# EAGLE design LED Ring Dimmer (EAGLE 9.6.2)
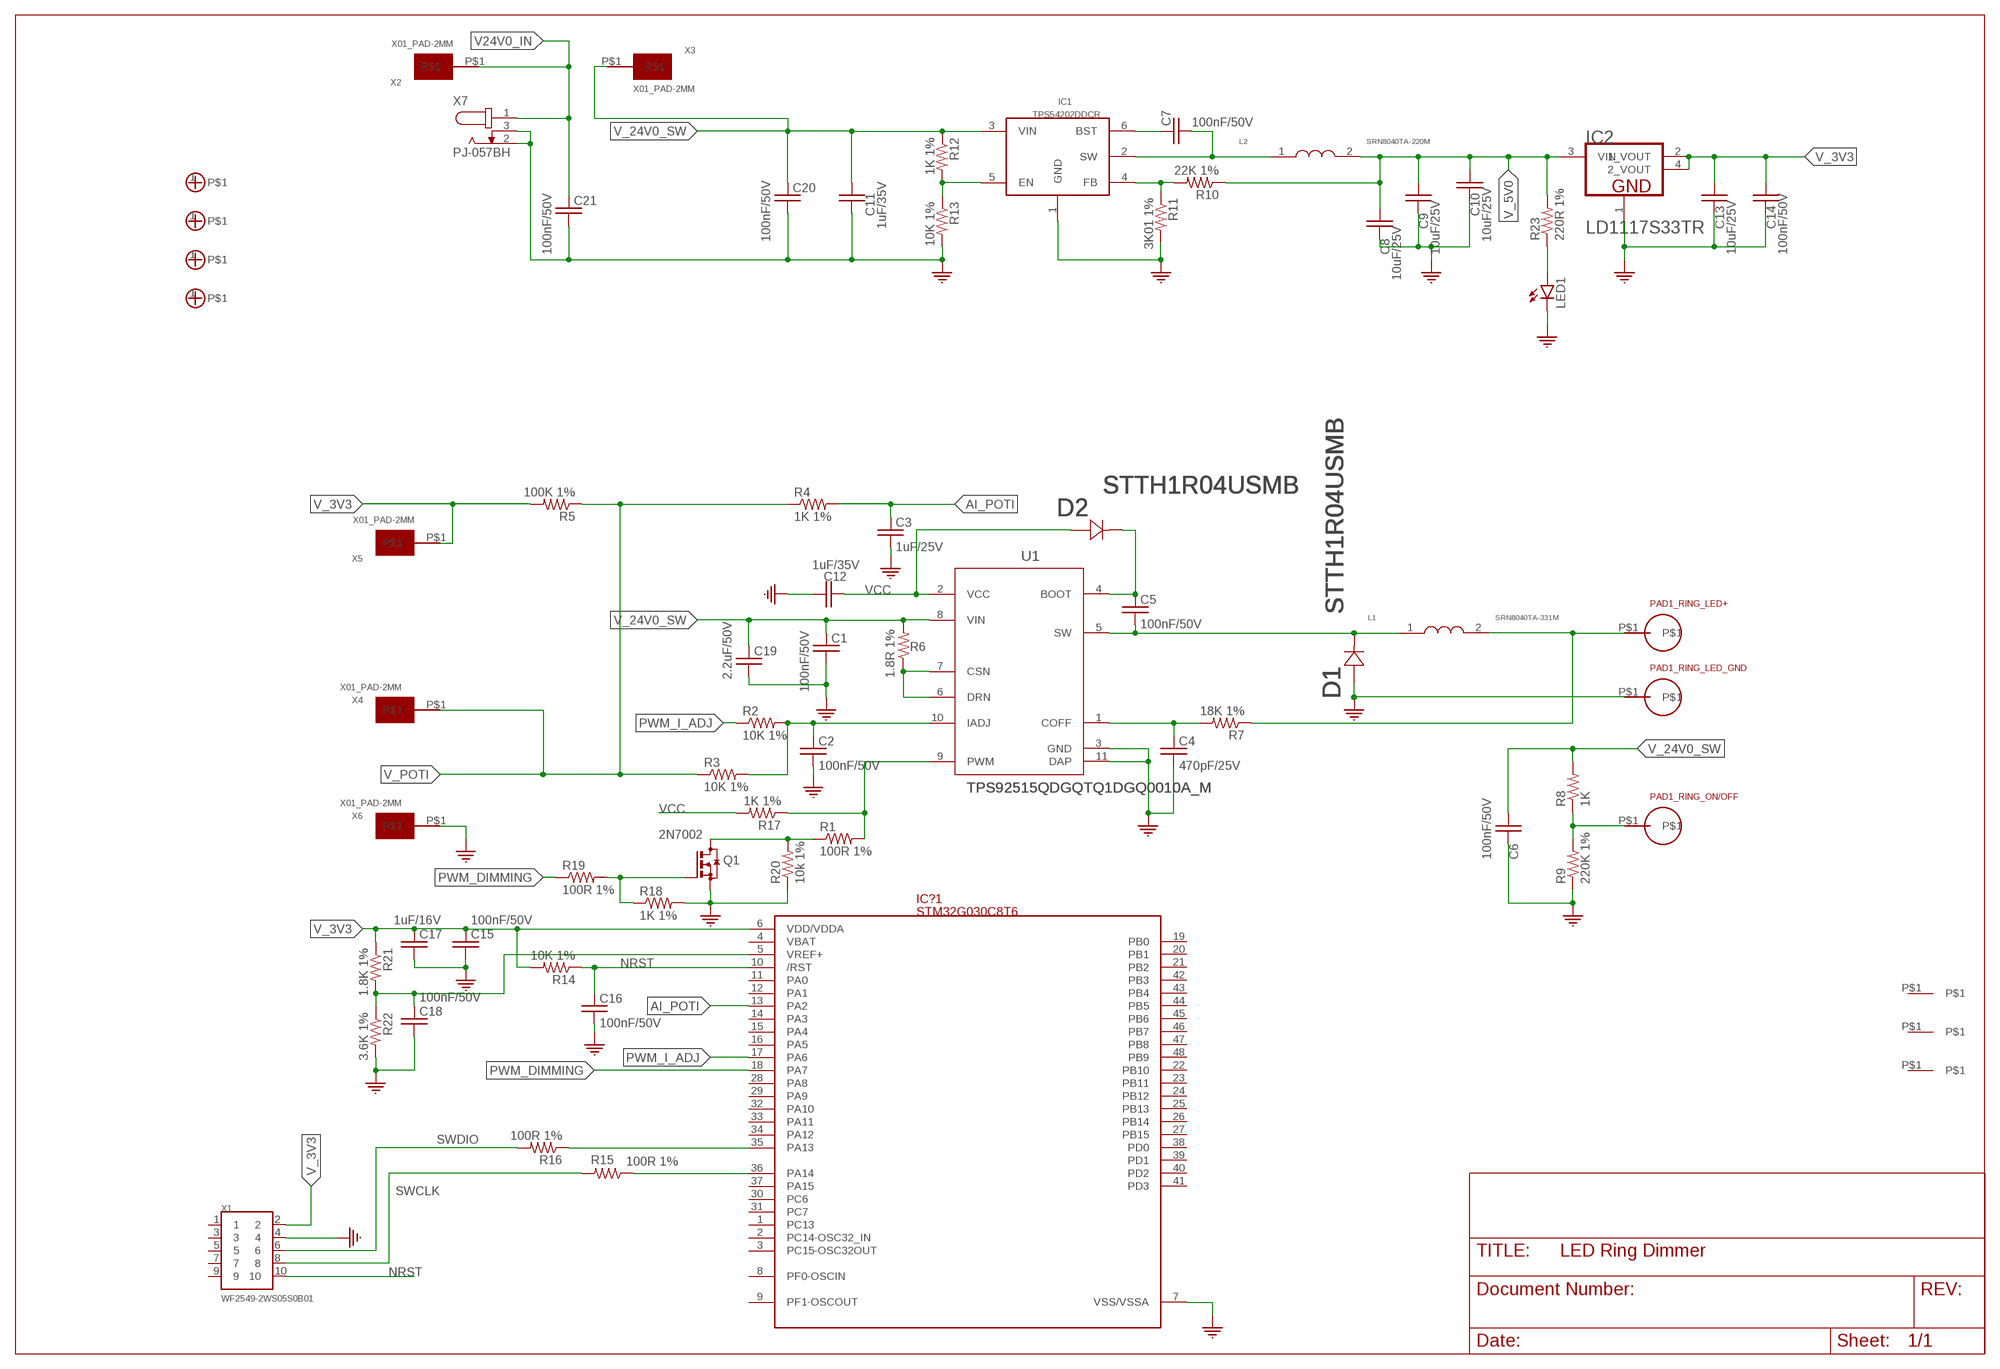
[diagram p0: schematic, sheet 1]

## Parts
C1  100nF/50V  C_0603EIA0603  [EIA0603]
C2  100nF/50V  C_0603EIA0603  [EIA0603]
C3  1uF/25V  C_0603EIA0603  [EIA0603]
C4  470pF/25V  C_0603EIA0603  [EIA0603]
C5  100nF/50V  C_0603EIA0603  [EIA0603]
C6  100nF/50V  C_0603EIA0603  [EIA0603]
C7  100nF/50V  C_0603EIA0603  [EIA0603]
C8  10uF/25V  C_0603EIA0603  [EIA0603]
C9  10uF/25V  C_0603EIA0603  [EIA0603]
C10  10uF/25V  C_0603EIA0603  [EIA0603]
C11  1uF/35V  C_0603EIA0603  [EIA0603]
C12  1uF/35V  C_0603EIA0603  [EIA0603]
C13  10uF/25V  C_0603EIA0603  [EIA0603]
C14  100nF/50V  C_0603EIA0603  [EIA0603]
C15  100nF/50V  C_0603EIA0603  [EIA0603]
C16  100nF/50V  C_0603EIA0603  [EIA0603]
C17  1uF/16V  C_0603EIA0603  [EIA0603]
C18  100nF/50V  C_0603EIA0603  [EIA0603]
C19  2.2uF/50V  C_0603EIA0603  [EIA0603]
C20  100nF/50V  C_0603EIA0603  [EIA0603]
C21  100nF/50V  C_0603EIA0603  [EIA0603]
D1  STTH1R04USMB  [SMB]
D2  STTH1R04USMB  [SMB]
FID1  FIDUCIAL  [FIDUCIAL]
FID2  FIDUCIAL  [FIDUCIAL]
FID3  FIDUCIAL  [FIDUCIAL]
IC1  TPS54202DDCR  [SOT23-6]
IC2  LD1117S33TR  [SOT223_LD1117S33TR]
IC?1  STM32G030C8T6  [LQFP48]
L1  SRN8040TA-331M  [SRN8040TA-220M]
L2  SRN8040TA-220M  [SRN8040TA-220M]
LED1  LED5MM  [LED5MM]
M1  M_HOLE_3M  [PCB_SCREW_M3_POWER]
M2  M_HOLE_3M  [PCB_SCREW_M3_POWER]
M3  M_HOLE_3M  [PCB_SCREW_M3_POWER]
M4  M_HOLE_3M  [PCB_SCREW_M3_POWER]
PAD1_RING_LED+  THT_PAD_5MM  [THT_PAD_D5.0]
PAD1_RING_LED_GND  THT_PAD_5MM  [THT_PAD_D5.0]
PAD1_RING_ON/OFF  THT_PAD_5MM  [THT_PAD_D5.0]
Q1  2N7002  [SOT23]
R1  100R 1%  R_0603  [EIA0603]
R2  10K 1%  R_0603  [EIA0603]
R3  10K 1%  R_0603  [EIA0603]
R4  1K 1%  R_0603  [EIA0603]
R5  100K 1%  R_0603  [EIA0603]
R6  1.8R 1%  R_1206EIA1206  [EIA1206]
R7  18K 1%  R_0603  [EIA0603]
R8  1K  R_0603  [EIA0603]
R9  220K 1%  R_0603  [EIA0603]
R10  22K 1%  R_0603  [EIA0603]
R11  3K01 1%  R_0603  [EIA0603]
R12  1K 1%  R_0603  [EIA0603]
R13  10K 1%  R_0603  [EIA0603]
R14  10K 1%  R_0603  [EIA0603]
R15  100R 1%  R_0603  [EIA0603]
R16  100R 1%  R_0603  [EIA0603]
R17  1K 1%  R_0603  [EIA0603]
R18  1K 1%  R_0603  [EIA0603]
R19  100R 1%  R_0603  [EIA0603]
R20  10k 1%  R_0603  [EIA0603]
R21  1.8K 1%  R_0603  [EIA0603]
R22  3.6K 1%  R_0603  [EIA0603]
R23  220R 1%  R_1206EIA1206  [EIA1206]
U1  TPS92515QDGQTQ1DGQ0010A_M  [DGQ0010A_M]
X1  WF2549-2WS05S0B01  [X10_100MIL_2XROW_VERT]
X2  X01_PAD-2MM  [X01_PAD-2MM]
X3  X01_PAD-2MM  [X01_PAD-2MM]
X4  X01_PAD-2MM  [X01_PAD-2MM]
X5  X01_PAD-2MM  [X01_PAD-2MM]
X6  X01_PAD-2MM  [X01_PAD-2MM]
X7  PJ-057BH  [CUI_PJ-057BH]

## Nets
AI_POTI: C3.1 IC?1.13(PA2) R4.2
GND: C1.2 C2.2 C3.2 C4.2 C6.2 C8.2 C9.2 C10.2 C11.2 C12.1 C13.2 C14.2 C15.2 C16.2 C17.2 C18.2 C19.2 C20.2 C21.2 D1.A IC1.1(GND) IC2.1(GND) IC?1.7(VSS/VSSA) LED1.K(C) PAD1_RING_LED_GND.P$1 Q1.2(S) R9.1 R11.2 R13.2 R18.2 R20.1 R22.2 U1.3(GND) U1.11(DAP) X1.4 X6.P$1 X7.2 X7.3
N$1: LED1.A R23.1
N$2: C5.2 D1.K(C) L1.1 U1.5(SW)
N$3: R6.1 U1.6(DRN) U1.7(CSN)
N$4: C2.1 R2.2 R3.2 U1.10(IADJ)
N$5: C4.1 R7.2 U1.1(COFF)
N$6: R1.2 R17.1 U1.9(PWM)
N$7: L1.2 PAD1_RING_LED+.P$1 R7.1
N$8: C5.1 D2.K(C) U1.4(BOOT)
N$9: PAD1_RING_ON/OFF.P$1 R8.1 R9.2
N$10: C7.1 IC1.6(BST)
N$11: C7.2 IC1.2(SW) L2.1
N$12: IC1.4(FB) R10.2 R11.1
N$13: Q1.3(D) R1.1 R20.2
N$14: IC1.5(EN) R12.2 R13.1
N$15: Q1.1(G) R18.1 R19.2
N$16: C18.1 IC?1.5(VREF+) R21.2 R22.1
N$17: IC?1.35(PA13) R16.1
N$18: IC?1.36(PA14) R15.1
NRST: C16.1 IC?1.10(/RST) R14.1 X1.10
PWM_DIMMING: IC?1.18(PA7) R19.1
PWM_I_ADJ: IC?1.17(PA6) R2.1
SWCLK: R15.2 X1.8
SWDIO: R16.2 X1.6
V24V0_IN: C21.1 X2.P$1 X7.1
V_3V3: C13.1 C14.1 C15.1 C17.1 IC2.2(1_VOUT) IC2.4(2_VOUT) IC?1.6(VDD/VDDA) R5.2 R14.2 R21.1 X1.2 X5.P$1
V_5V0: C8.1 C9.1 C10.1 IC2.3(VIN) L2.2 R10.1 R23.2
V_24V0_SW: C1.1 C6.1 C11.1 C19.1 C20.1 IC1.3(VIN) R6.2 R8.2 R12.1 U1.8(VIN) X3.P$1
V_POTI: R3.1 R4.1 R5.1 X4.P$1
VCC: C12.2 D2.A R17.2 U1.2(VCC)
Unconnected: FID1.P$1 FID2.P$1 FID3.P$1 IC?1.1(PC13) IC?1.2(PC14-OSC32_IN) IC?1.3(PC15-OSC32OUT) IC?1.4(VBAT) IC?1.8(PF0-OSCIN) IC?1.9(PF1-OSCOUT) IC?1.11(PA0) IC?1.12(PA1) IC?1.14(PA3) IC?1.15(PA4) IC?1.16(PA5) IC?1.19(PB0) IC?1.20(PB1) IC?1.21(PB2) IC?1.22(PB10) IC?1.23(PB11) IC?1.24(PB12) IC?1.25(PB13) IC?1.26(PB14) IC?1.27(PB15) IC?1.28(PA8) IC?1.29(PA9) IC?1.30(PC6) IC?1.31(PC7) IC?1.32(PA10) IC?1.33(PA11) IC?1.34(PA12) IC?1.37(PA15) IC?1.38(PD0) IC?1.39(PD1) IC?1.40(PD2) IC?1.41(PD3) IC?1.42(PB3) IC?1.43(PB4) IC?1.44(PB5) IC?1.45(PB6) IC?1.46(PB7) IC?1.47(PB8) IC?1.48(PB9) M1.1 M2.1 M3.1 M4.1 X1.1 X1.3 X1.5 X1.7 X1.9

## Library data of the parts
C1-C21 = Labops_Lib_AH:C_0603
D1 D2 = Labops_Lib_AH:STTH1R04U; DESCRIPTION: 1A, 400V, SMB, Fast Recovery; MFN: STTH1R04U; PART_VALUE: STTH1R04U
FID1-FID3 = Labops_Lib_AH:FIDUCIAL
IC1 = Labops_Lib_AH:TPS54202DDCR; DESCRIPTION: 2A 28V SOT-23-6 Sync Buck; LIB_STATUS: Prototype; MFN: TPS54202DDCR; MFR: Texas Instruments; OUR_STOCK: 40; PART_VALUE: TPS54202; PRICE-1: 1.8; SUPPLIER-1: LCSC
IC2 = Labops_Lib_AH:LD1117S33TR: IC REG LINEAR 3.3V 800mA SOT223; DESCRIPTION: LDO,Fixed 15V 3.3V 1.3V @ 800mA SOT-223; LIB_STATUS: Verified; MFN: LD1117S33TR; MFR: STmicro, Diodes, TI,; OUR_STOCK: 10; PART_VALUE: xx1117x33xx; PRICE-1: 0.07; SUPPLIER-1: LCSC
IC?1 = Labops_Lib_AH:STM32G030C8T6
L1 = Labops_Lib_AH:SRN8040TA-331M: FIXED IND 22UH 2.9A SMD, 73m-Ohm, Bourns; DESCRIPTION: FIXED IND 330UH 0.66A SMD, Bourns; LIB_STATUS: Verified; MFN: SRN8040TA-331M; MFR: Bourns; OUR_STOCK: 10; PART_VALUE: 330uH/0.66A; SUPPLIER-1: Digikey; TECHNOLOGY: SMD
L2 = Labops_Lib_AH:SRN8040TA-220M: FIXED IND 22UH 2.9A SMD, 73m-Ohm, Bourns; DESCRIPTION: FIXED IND 22UH 2.9A SMD, 73m-Ohm, Bourns; LIB_STATUS: Verified; MFN: SRN8040TA-220M; MFR: Bourns; OUR_STOCK: 10; PART_VALUE: 22uH/2.9A; SUPPLIER-1: Digikey; TECHNOLOGY: SMD
LED1 = led:LED: LED OSRAM: - CHIPLED LG R971, LG N971, LY N971, LG Q971, LY Q971, LO R971, LY R971 LH N974, LH R974 LS Q976, LO Q976, LY Q976 LO Q996 - Hyper CHIPLED LW Q18S LB Q993, LB Q99A, LB R99A - SideLED LS A670, LO A670, LY A670, LG A670, LP A670 LB A673, LV A673, LT A673, LW A673 LH A674 LY A675 LS A676, LA A676, LO A676, LY A676, LW A676 LS A679, LY A679, LG A679 - Hyper Micro SIDELED® LS Y876, LA Y876, LO Y876, LY Y876 LT Y87S - SmartLED LW L88C, LW L88S LB L89C, LB L89S, LG L890 LS L89K, LO L89K, LY L89K LS L896, LA L896, LO L896, LY L896 - TOPLED LS T670, LO T670, LY T670, LG T670, LP T670 LSG T670, LSP T670, LSY T670, LOP T670, LYG T670 LG T671, LOG T671, LSG T671 LB T673, LV T673, LT T673, LW T673 LH T674 LS T676, LA T676, LO T676, LY T676, LB T676, LH T676, LSB T676, LW T676 LB T67C, LV T67C, LT T67C, LS T67K, LO T67K, LY T67K, LW E67C LS E67B, LA E67B, LO E67B, LY E67B, LB E67C, LV E67C, LT E67C LW T67C LS T679, LY T679, LG T679 LS T770, LO T770, LY T770, LG T770, LP T770 LB T773, LV T773, LT T773, LW T773 LH T774 LS E675, LA E675, LY E675, LS T675 LS T776, LA T776, LO T776, LY T776, LB T776 LHGB T686 LT T68C, LB T68C - Hyper Mini TOPLED® LB M676 - Mini TOPLED Santana® LG M470 LS M47K, LO M47K, LY M47K Source: http://www.osram.convergy.de LUXEON: - LUMILED® LXK2-PW12-R00, LXK2-PW12-S00, LXK2-PW14-U00, LXK2-PW14-V00 LXK2-PM12-R00, LXK2-PM12-S00, LXK2-PM14-U00 LXK2-PE12-Q00, LXK2-PE12-R00, LXK2-PE12-S00, LXK2-PE14-T00, LXK2-PE14-U00 LXK2-PB12-K00, LXK2-PB12-L00, LXK2-PB12-M00, LXK2-PB14-N00, LXK2-PB14-P00, LXK2-PB14-Q00 LXK2-PR12-L00, LXK2-PR12-M00, LXK2-PR14-Q00, LXK2-PR14-R00 LXK2-PD12-Q00, LXK2-PD12-R00, LXK2-PD12-S00 LXK2-PH12-R00, LXK2-PH12-S00 LXK2-PL12-P00, LXK2-PL12-Q00, LXK2-PL12-R00 Source: www.luxeon.com KINGBRIGHT: KA-3528ASYC Source: www.kingbright.com
M1-M4 = Labops_Lib_AH:M_HOLE_3M
PAD1_RING_LED+ PAD1_RING_LED_GND PAD1_RING_ON/OFF = Labops_Lib_AH:THT_PAD_5MM
Q1 = Labops_Lib_AH:2N7002; DESCRIPTION: NMOSFET, 500mA, 60V, Vth 2.5V; LIB_STATUS: Prototype; MFN: 2N7002; MFR: Diodes, Guangdong Hotetech,NXP; OUR_STOCK: 100; PART_VALUE: NMOSFET; PRICE-1: 0.02; SUPPLIER-1: LCSC
R1-R5 R7-R22 = Labops_Lib_AH:R_0603; MFN: Open Source 0603
R6 R23 = Labops_Lib_AH:R_1206; MFN: Open Source R1206
U1 = Labops_Lib_AH:TPS92515QDGQTQ1; COPYRIGHT: Copyright (C) 2023 Ultra Librarian. All rights reserved.; DESCRIPTION: LED Driver 2A, 42V, Buck, Analog and PWM Dimming,MSOP-PowerPad-10; MFN: TPS92515QDGQTQ1; MFR: Texas Instruments; PART_VALUE: TPS92515; REFDES: RefDes; TYPE: TYPE
X1 = Labops_Lib_AH:WF2549-2WS05S0B01; DESCRIPTION: X10, 10 Pins, Header, Pitch 2.54 wire to board 2xrows, THT; MFN: WF2549-2WS05S0B01; MFR: WCON; PRICE-1: 0.25; SUPPLIER-1: LCSC
X2-X6 = Labops_Lib_AH:X01_PAD-2MM
X7 = Labops_Lib_AH:PJ-057BH; DESCRIPTION: DC Power Connectors Power Jack 2.5mm, 2.5A, Male; MFN: PJ-057BH; MFR: CUI Devices; SUPPLIER-1: Mouser; TECHNOLOGY: THT

## Net classes
5 LV: width 0.203 mm, clearance 7 mm to class 1, clearance 7 mm to class 2, clearance 7 mm to class 3, clearance 7 mm to class 4, clearance 0.203 mm

## Board
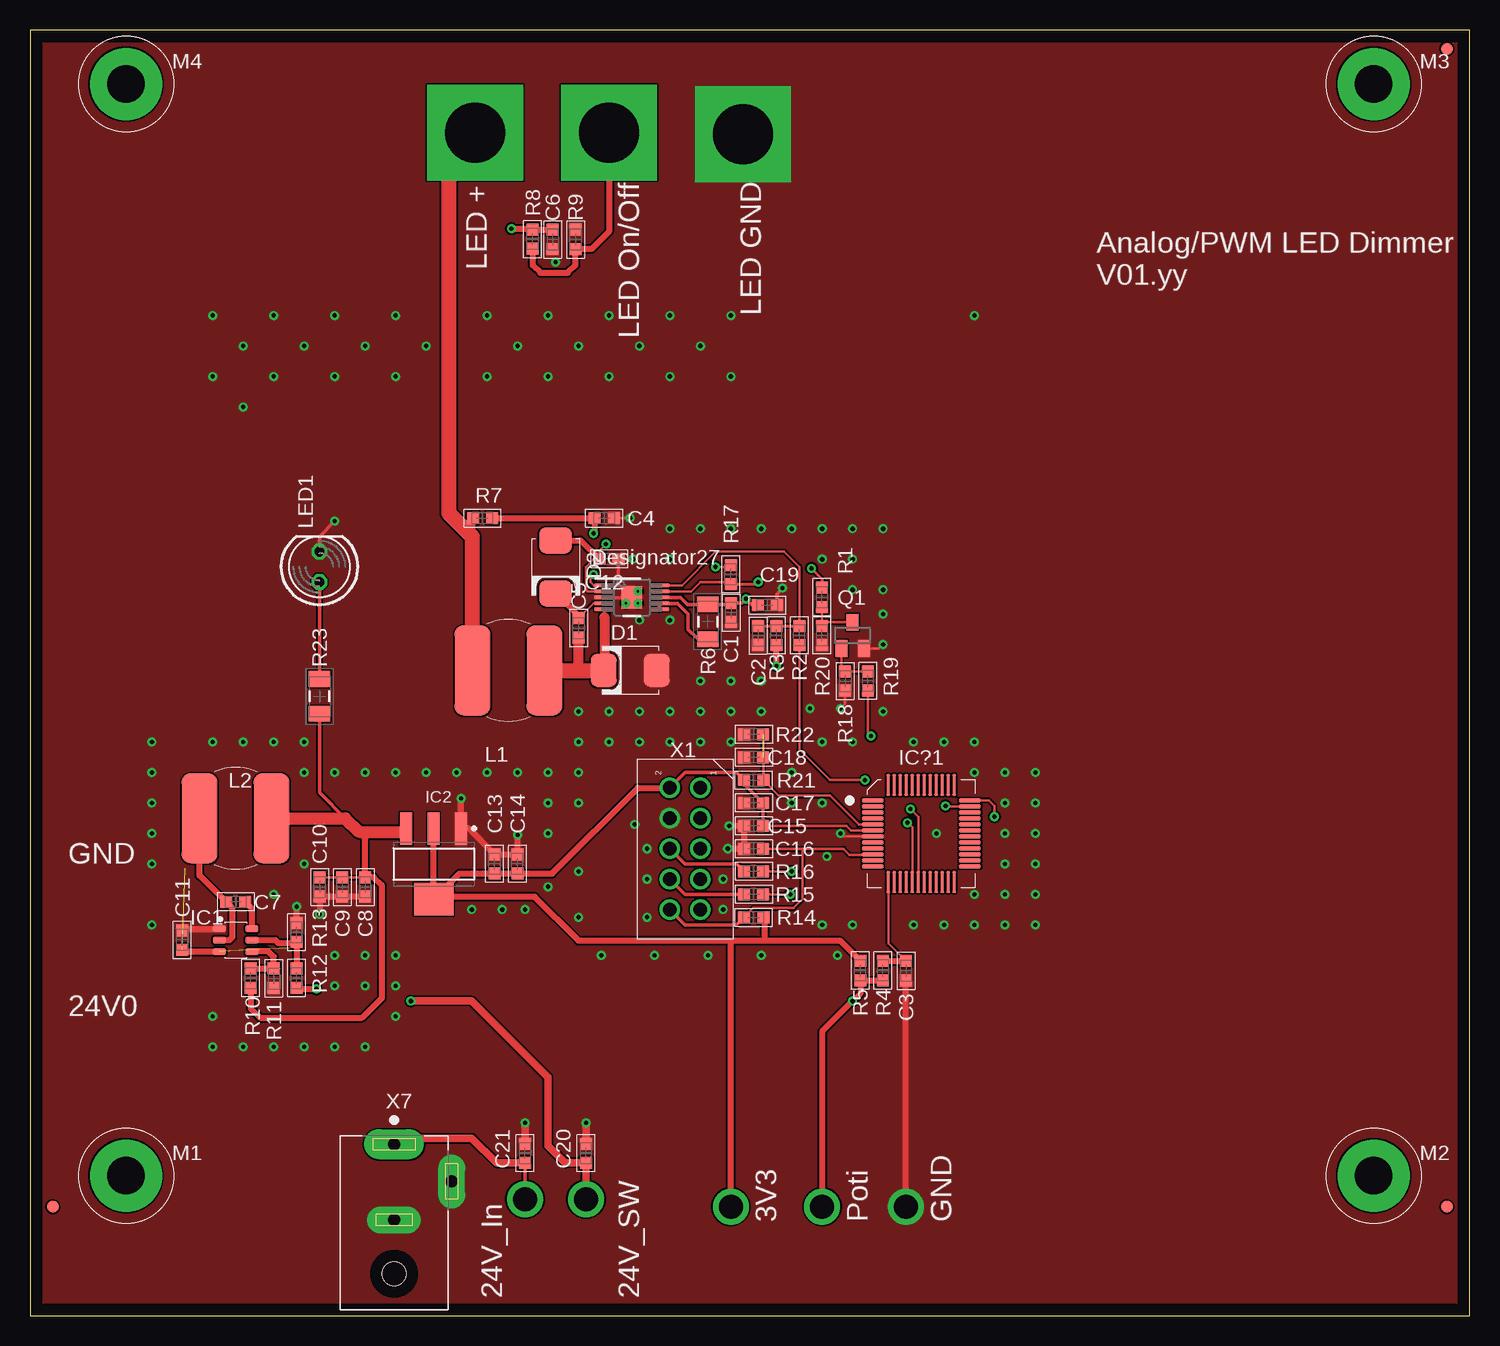
[diagram p1: board, top side]
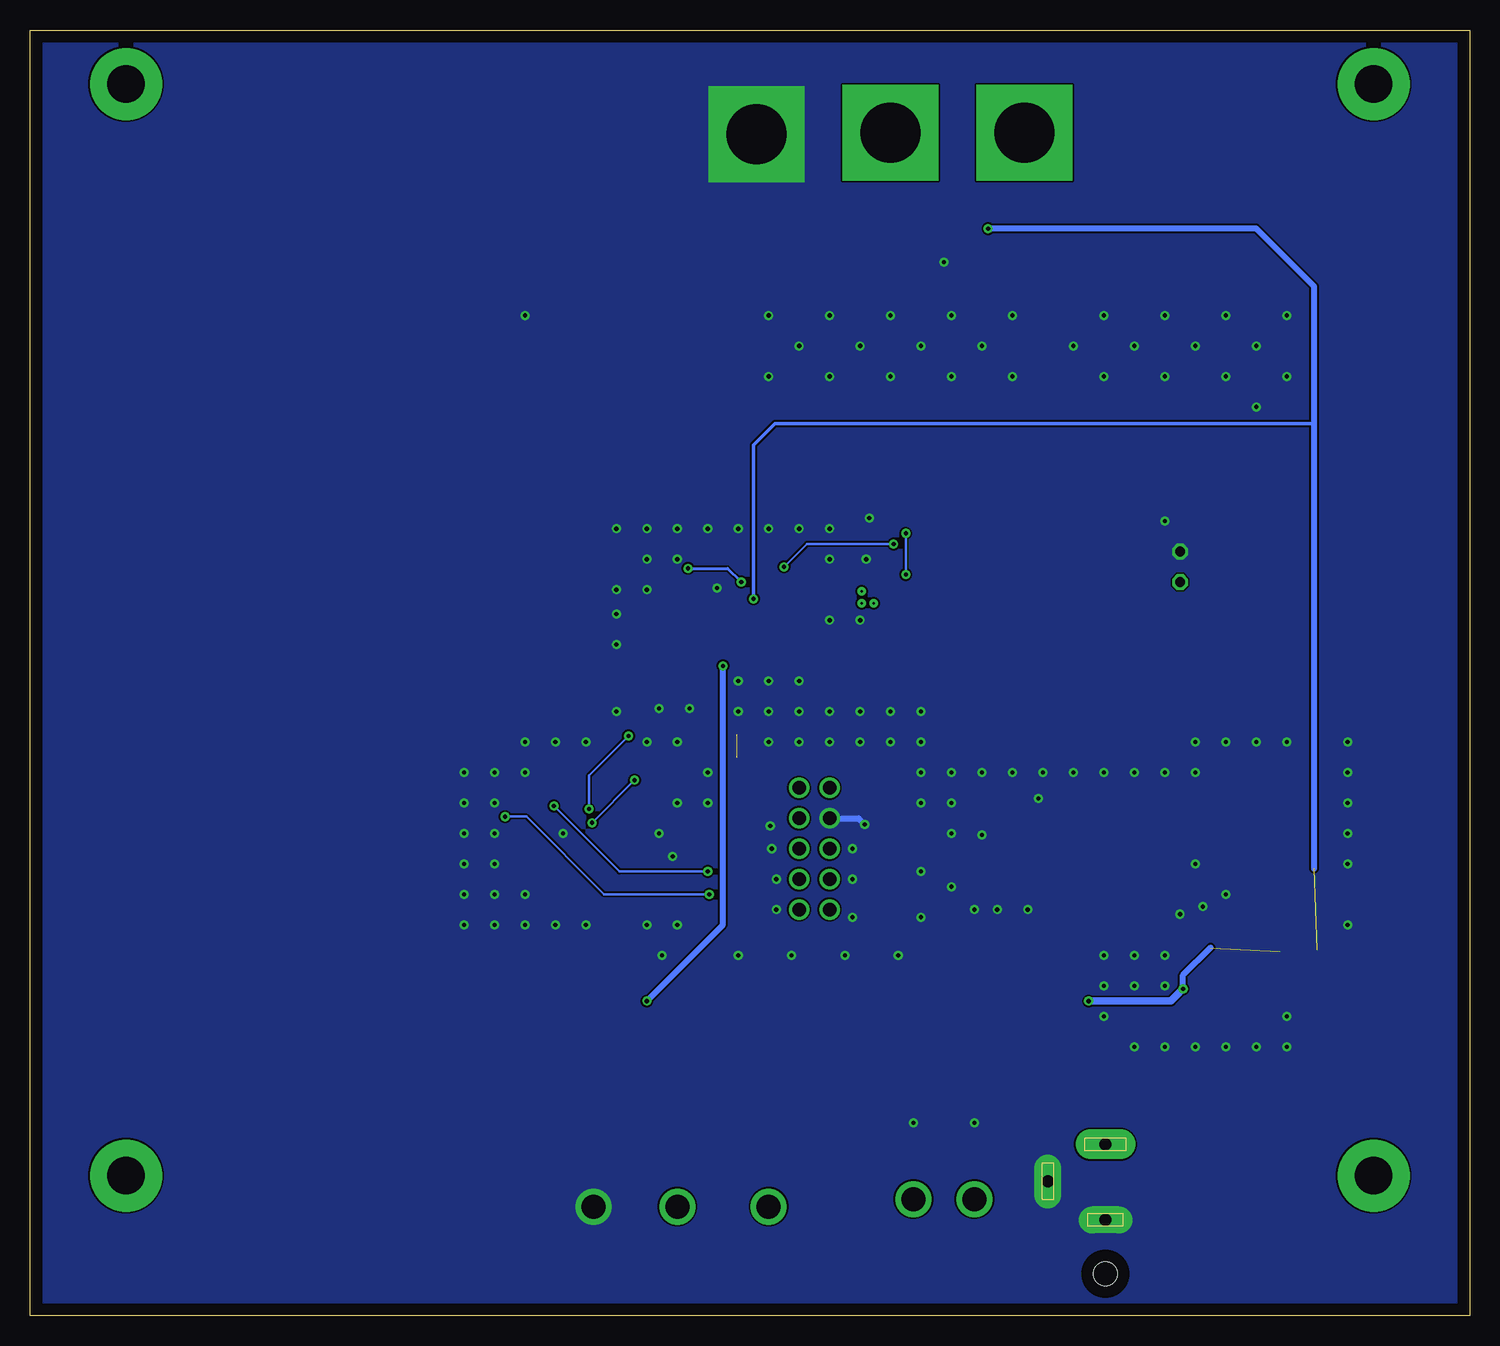
[diagram p2: board, bottom side, seen from below]

Size 120 x 107.19 mm. Coordinates in mm from the lower left corner, seen from the top.
Outline: 0,0 120,0 120,107.19 0,107.19 0,0
Copper layers (1*16): Top 0.035mm / dielectric 1.5mm / Bottom 0.035mm
Design rules "default *": minimum track width 6mil, minimum drill 0.35mm, track to track 6mil, track to pad 6mil, pad to pad 6mil, via to via 6mil, smd to smd 6mil, copper to edge 40mil, drill to drill 6mil, minimum pad ring 10mil, minimum via ring 8mil, stop-mask expansion 4mil, vias tented up to drill 20mil, thermal gap 10mil

### Footprints (pad centres in the part's own frame; a part is rotated, then mirrored left to right if it is on the bottom)
EIA0603 = smd 1 x 1: 1 -0.8,0; 2 0.8,0
SMB = smd 2.16 x 2.74: A -2.21,0; K 2.21,0
FIDUCIAL = smd 1 x 1: P$1 0,0
SOT23-6 = smd 0.6 x 1.1: 1 -0.95,-1.35; 2 0,-1.35; 3 0.95,-1.35; 4 0.95,1.35; 5 0,1.35; 6 -0.95,1.35
SOT223_LD1117S33TR = smd 2.7 x 1: 1 -2.95,2.3; 2 -2.95,0; 3 -2.95,-2.3 | smd 2.7 x 3.3: 4 2.95,0
LQFP48 = smd 1.8 x 0.3: 1 -4.05,2.75; 2 -4.05,2.25; 3 -4.05,1.75; 4 -4.05,1.25; 5 -4.05,0.75; 6 -4.05,0.25; 7 -4.05,-0.25; 8 -4.05,-0.75; 9 -4.05,-1.25; 10 -4.05,-1.75; 11 -4.05,-2.25; 12 -4.05,-2.75; 25 4.05,-2.75; 26 4.05,-2.25; 27 4.05,-1.75; 28 4.05,-1.25; 29 4.05,-0.75; 30 4.05,-0.25; 31 4.05,0.25; 32 4.05,0.75; 33 4.05,1.25; 34 4.05,1.75; 35 4.05,2.25; 36 4.05,2.75 | smd 0.3 x 1.8: 13 -2.75,-4.05; 14 -2.25,-4.05; 15 -1.75,-4.05; 16 -1.25,-4.05; 17 -0.75,-4.05; 18 -0.25,-4.05; 19 0.25,-4.05; 20 0.75,-4.05; 21 1.25,-4.05; 22 1.75,-4.05; 23 2.25,-4.05; 24 2.75,-4.05; 37 2.75,4.05; 38 2.25,4.05; 39 1.75,4.05; 40 1.25,4.05; 41 0.75,4.05; 42 0.25,4.05; 43 -0.25,4.05; 44 -0.75,4.05; 45 -1.25,4.05; 46 -1.75,4.05; 47 -2.25,4.05; 48 -2.75,4.05
SRN8040TA-220M = smd 3 x 7.5: 1 -3,0; 2 3,0
LED5MM = drill 0.813 octagon: A -1.27,0; K 1.27,0
PCB_SCREW_M3_POWER = drill 3.1 pad 6: 1 0,0
THT_PAD_D5.0 = drill 5 pad 8 square: P$1 0,0
SOT23 = smd 1 x 1.4: 1 -0.95,-1.1; 2 0.95,-1.1; 3 0,1.1
EIA1206 = smd 1.3 x 1.8: 1 -1.45,0; 2 1.45,0
DGQ0010A_M = smd 1.55 x 0.3: 1 -2.325,1; 2 -2.325,0.5; 3 -2.325,0; 4 -2.325,-0.5; 5 -2.325,-1; 6 2.325,-1; 7 2.325,-0.5; 8 2.325,0; 9 2.325,0.5; 10 2.325,1 | smd 1.73 x 1.9: 11 0,0 | drill 0.203 pad 0.5: V_1 0.5,0.5; V_2 -0.5,-0.5; V_3 0.5,-0.5
X10_100MIL_2XROW_VERT = drill 1.1 pad 1.7: 1 -5.08,1.27; 2 -5.08,-1.27; 3 -2.54,1.27; 4 -2.54,-1.27; 5 0,1.27; 6 0,-1.27; 7 2.54,1.27; 8 2.54,-1.27; 9 5.08,1.27; 10 5.08,-1.27
X01_PAD-2MM = drill 2: P$1 0,0
CUI_PJ-057BH = drill 1 pad 2.5 long: 1 0,0 | drill 1 pad 2.25 long: 2 6.3,0; 3 3.1,4.8 | hole 2: 10.8,0

### Placement (x,y rotation side)
C1  58.42,58.63 270 top
C2  60.71,56.73 270 top
C3  73.03,28.79 270 top
C4  47.88,66.5 0 top
C5  45.72,57.36 270 top
C6  43.56,89.75 270 top
C7  17.14,34.5 180 top
C8  27.94,35.77 270 top
C9  26.04,35.77 270 top
C10  24.13,35.77 270 top
C11  12.7,31.32 90 top
C12  48.26,63.08 180 top
C13  38.73,37.67 90 top
C14  40.64,37.67 90 top
C15  60.33,40.85 180 top
C16  60.33,38.95 180 top
C17  60.33,42.76 180 top
C18  60.33,46.56 180 top
C19  61.47,59.27 0 top
C20  46.35,13.54 90 top
C21  41.27,13.54 90 top
D1  50.04,53.8 180 top
D2  43.81,62.44 270 top
FID1  1.91,9.1 0 top
FID2  118.11,105.62 0 top
FID3  118.11,9.1 0 top
IC1  17.14,31.32 270 top
IC2  33.66,37.67 270 top
IC?1  74.3,40.22 0 top
L1  39.88,53.8 180 top
L2  17.14,41.48 0 top
LED1  24.13,62.44 90 top
M1  8,11.7 0 top
M2  112,11.7 0 top
M3  112,102.69 0 top
M4  8,102.69 0 top
PAD1_RING_LED+  37.08,98.63 0 top
PAD1_RING_LED_GND  59.44,98.51 0 top
PAD1_RING_ON/OFF  48.26,98.63 0 top
Q1  68.58,56.73 0 top
R1  66.04,59.9 90 top
R2  64.14,56.73 90 top
R3  62.23,56.73 90 top
R4  71.12,28.79 90 top
R5  69.22,28.79 90 top
R6  56.52,57.87 90 top
R7  37.72,66.5 0 top
R8  41.91,89.75 90 top
R9  45.47,89.75 270 top
R10  18.41,28.15 90 top
R11  20.32,28.15 270 top
R12  22.23,28.15 90 top
R13  22.23,31.96 90 top
R14  60.33,33.23 0 top
R15  60.33,35.14 180 top
R16  60.33,37.04 180 top
R17  58.42,61.8 90 top
R18  67.94,52.91 270 top
R19  69.85,52.91 90 top
R20  66.04,56.73 90 top
R21  60.33,44.66 0 top
R22  60.33,48.47 180 top
R23  24.13,51.65 270 top
U1  50.16,59.9 0 top
X1  54.61,38.95 270 top
X2  41.27,9.73 0 top
X3  46.35,9.73 0 top
X4  66.04,9.1 0 top
X5  58.42,9.1 0 top
X6  73.03,9.1 0 top
X7  30.35,14.31 270 top

### Tracks (layer width: path | path; a pad name or v marks a point on that pad's centre or on a via)
AI_POTI
  Top 0.203: C3.1 71.55,31.07 IC?1.13
  Top 0.508: R4.2 C3.1 | C3.1
GND  (via drill 0.35)
  Top 0.203: IC?1.7 67.81,39.97 v67.56,40.22 | Q1.2 70.78,55.62 v71.12,55.96 | C4.2 v50.04,66.5 | C12.1 v50.29,63.08 | R18.2 67.94,51.01 v67.56,50.63
  Top 0.254: U1.3 49.27,59.9 49.4,60.04 | U1.11 49.06,61.01 C12.1
  Top 0.305: C19.2 62.27,60.19 v62.74,60.66 | LED1.K 24.13,64.98 v25.4,66.25
  Top 0.508: C11.2 12.85,32.27 IC1.1 | X6.P$1 C3.2 | IC2.1 36.59,40.62 C13.2 C14.2 v40.64,40.09 | C8.2 C10.2 v24.13,33.48 | R13.2 v22.23,34.12 | IC2.1 35.95,43.14 | IC2.1 35.94,40.64 v35.94,43.14 | v58.29,40.85 C15.2 C16.2 v58.17,38.95
  Top 0.61: C21.2 v41.27,16.09 | C20.2 v46.35,16.09
  Bottom 0.508: X1.4 50.93,41.48 v50.42,40.98
  other vias: 43.81,87.84 78.74,83.4 15.24,83.4 20.32,83.4 25.4,83.4 30.48,83.4 33.02,80.85 27.94,80.85 22.86,80.85 17.78,80.85 15.24,78.31 20.32,78.31 25.4,78.31 30.48,78.31 38.1,83.4 43.18,83.4 48.26,83.4 53.34,83.4 58.42,83.4 40.64,80.85 45.72,80.85 50.8,80.85 55.88,80.85 58.42,78.31 53.34,78.31 48.26,78.31 43.18,78.31 38.1,78.31 17.78,75.78 60.96,65.62 55.88,65.62 66.04,65.62 71.12,65.62 71.12,60.54 71.12,50.38 65.02,50.63 60.96,50.38 60.96,52.91 55.88,52.91 55.88,50.38 55.88,47.84 53.34,57.99 53.34,50.38 50.8,50.38 48.26,50.38 45.72,50.38 53.34,47.84 50.8,47.84 48.26,47.84 45.72,47.84 58.42,50.38 58.42,47.84 58.42,52.91 50.8,57.99 53.34,63.08 53.34,65.62 58.42,65.62 63.5,65.62 68.58,65.62 68.58,63.08 66.04,63.08 68.58,60.54 71.12,58.5 63.5,45.3 66.04,47.84 68.58,47.84 73.66,47.84 76.2,47.84 78.74,47.84 78.74,45.3 81.28,45.3 81.28,42.76 81.28,40.22 81.28,37.67 81.28,35.14 78.74,35.14 76.2,32.59 78.74,32.59 81.28,32.59 73.66,32.59 68.58,32.59 66.04,32.59 83.82,45.3 83.82,42.76 83.82,40.22 83.82,37.67 83.82,35.14 83.82,32.59 66.04,42.76 63.5,42.76 45.72,45.3 45.72,42.76 43.18,42.76 43.18,40.22 43.18,45.3 40.64,45.3 38.1,45.3 35.56,45.3 33.02,45.3 30.48,45.3 27.94,45.3 25.4,45.3 20.32,35.14 10.16,37.67 10.16,40.22 10.16,42.76 10.16,45.3 10.16,47.84 15.24,47.84 17.78,47.84 20.32,47.84 22.86,47.84 22.86,45.3 22.86,37.67 30.48,30.05 30.48,27.52 30.48,24.98 27.94,22.44 27.94,27.52 25.4,27.52 25.4,30.05 27.94,30.05 25.4,22.44 22.86,22.44 20.32,22.44 17.78,22.44 15.24,24.98 15.24,22.44 10.16,32.59 43.18,35.77 45.72,37.04 45.72,33.23 39.37,33.87 41.27,33.87 36.83,33.87 67.31,30.05 47.62,30.05 52.07,30.05 56.52,30.05 60.96,30.05 57.78,36.41 57.78,33.87 51.44,33.23 51.44,36.41 51.44,38.95 66.42,38.31 75.56,40.22
  pour Top (no thermals): 0,0.34 0,107.14 120.02,107.14 120.02,0.34
  pour Bottom (no thermals): 0,0.34 0,107.14 120.02,107.14 120.02,0.34
N$1
  Top 0.305: R23.1 LED1.A | LED1.A
N$2
  Top 0.203: 47.88,58.25 47.88,58.86 U1.5
  Top 0.813: 45.72,53.8 C5.2 | 47.88,58.25 47.88,53.85 D1.K
  Top 1.27: L1.1 45.72,53.8 D1.K
N$3
  Top 0.305: U1.6 U1.7 53.97,59.4 54.86,58.5 54.86,57.23 55.68,56.42 R6.1
N$4
  Top 0.203: U1.10 54.34,60.9 57.15,63.71 62.87,63.71 64.14,62.44 R2.2 62.36,57.52 R3.2
  Top 0.254: C2.1 62.36,57.52 | 62.36,57.52 | R3.2 R2.2
N$5  (via drill 0.35)
  Top 0.203: U1.1 47.01,60.9 46.74,61.17 46.74,61.68 46.86,61.8 v46.99,61.8
  Top 0.508: R7.2 C4.1 47.08,65.32 v46.99,65.23
  Bottom 0.203: v46.99,61.8 v46.99,65.23
N$6  (via drill 0.35)
  Top 0.203: U1.9 55.11,60.4 55.88,61.17 58.26,61.17 R17.1
  Top 0.254: R17.1 60.54,61.01 v60.71,61.17 | v65.15,62.31 66.04,61.42 R1.2
  Bottom 0.254: v60.71,61.17 61.85,62.31 v65.15,62.31
N$7
  Top 0.508: L1.2 36.88,66.46 R7.1
  Top 1.27: L1.2 36.88,64.93 34.92,66.88 34.92,96.48 PAD1_RING_LED+.P$1
N$8
  Top 0.203: C5.1 46.96,59.4 U1.4
  Top 0.508: D2.K 45.72,58.33 C5.1
N$9
  Top 0.508: R8.1 41.91,87.59 42.55,86.95 44.83,86.95 45.47,87.59 R9.2 46.83,88.94 48.26,90.38 PAD1_RING_ON/OFF.P$1
N$10
  Top 0.508: C7.1 18.5,33.95 IC1.6
N$11
  Top 0.508: IC1.2 16.64,31.32 16.89,31.58 16.89,33.95 C7.2 14.14,36.7 L2.1
N$12
  Top 0.508: R11.1 20.32,29.93 19.87,30.38 IC1.4 | R10.2 R11.1 | R11.1
N$13
  Top 0.203: R1.1 R20.2 66.34,57.83 Q1.3
N$14
  Top 0.508: IC1.5 20.45,31.32 20.7,31.07 22.14,31.07 R13.1 R12.2
N$15
  Top 0.203: Q1.1 67.63,54.03 R18.1 R19.2 | R19.2
N$16  (1 unrouted)
  Top 0.203: IC?1.5 69.1,40.97 66.67,43.39 62.4,43.39 R21.2 | R21.2 | R21.2 R22.1 | R22.1
N$17  (via drill 0.35)
  Top 0.203: R16.1 v63.5,37.04 | v76.33,42.5 76.36,42.47 IC?1.35
  Bottom 0.203: v63.5,37.04 70.87,37.04 v76.33,42.5
N$18  (via drill 0.35)
  Top 0.203: R15.1 v63.37,35.14 | v80.39,41.61 80.39,42.5 79.93,42.97 IC?1.36
  Bottom 0.203: v63.37,35.14 72.14,35.14 78.61,41.61 v80.39,41.61
NRST
  Top 0.203: C16.1 64.39,38.95 | 64.39,38.95 67.82,38.95 68.33,38.44 70.22,38.44 IC?1.10 | R14.1 60.29,33.99 63.63,33.99 64.39,34.75 64.39,38.95
  Top 0.305: X1.10 54.61,32.59 58.89,32.59 R14.1
PWM_DIMMING  (via drill 0.35)
  Top 0.203: IC?1.18 74.05,41.61 v73.41,42.25 | v70.1,48.34 69.85,48.6 R19.1
  Bottom 0.203: v73.41,42.25 73.41,45.04 v70.1,48.34
PWM_I_ADJ  (via drill 0.35)
  Top 0.203: R2.1 64.14,47.2 66.67,44.66 v69.6,44.66 | v73.15,41.1 73.55,40.71 IC?1.17
  Bottom 0.203: v73.15,41.1 v69.6,44.66
SWCLK
  Top 0.305: X1.8 54.61,35.14 R15.2
SWDIO
  Top 0.305: X1.6 54.61,37.67 58.89,37.67 R16.2
V24V0_IN
  Top 0.305: C21.1 X2.P$1
  Top 0.61: X7.1 30.86,14.82 36.83,14.82 38.9,12.75 C21.1
V_3V3
  Top 0.203: C15.1 68.07,40.85 68.46,40.47 IC?1.6
  Top 0.305: X1.2 54.61,45.3 58.89,45.3 R21.1 59.52,44.35 C17.1 C15.1
  Top 0.508: IC2.2 IC2.4 33.86,34.93 | 33.86,34.93 35.8,36.88 C13.1 C14.1 43.52,36.88 50.67,44.02 X1.2 | X5.P$1 58.42,31.29 | 58.42,31.29 45.72,31.29 42.08,34.93 33.86,34.93 | 58.42,31.29 61.21,31.29 | 61.21,31.29 67.51,31.29 R5.2 | R14.2 61.21,33.14 61.21,31.29
V_5V0
  Top 0.203: C10.1 C9.1 C8.1
  Top 0.305: R23.2 24.13,43.64 26.29,41.48
  Top 0.508: R10.1 18.41,25.61 19.18,24.85 27.69,24.85 29.34,26.5 29.34,35.9 28.66,36.57 C8.1 27.94,39.83 27.43,40.34
  Top 1.016: L2.2 26.29,41.48 27.43,40.34 31.07,40.34 IC2.3
V_24V0_SW  (via drill 0.35)  (2 unrouted)
  Top 0.203: 56.52,59.3 R6.2
  Top 0.305: U1.8 54.23,59.9 54.83,59.3 56.52,59.3 | R6.2 58.31,59.32 C1.1 59.35,59.43 v59.69,59.77 60.2,59.27 C19.1
  Top 0.508: C11.1 12.85,30.38 IC1.3 | R12.1 22.31,27.26 v23.88,27.26 | v40.13,90.63 41.82,90.63 R8.2 C6.1 | C6.1
  Top 0.61: X3.P$1 C20.1 44.62,12.75 43.18,14.18 43.18,19.89 36.83,26.25 v31.75,26.25
  Bottom 0.305: v59.69,59.77 59.69,72.6 57.91,74.38 12.95,74.38
  Bottom 0.508: v23.88,27.26 23.88,28.4 21.59,30.69 | 12.95,37.29 12.95,74.38 12.95,85.81 17.78,90.63 v40.13,90.63
  Bottom 0.61: v31.75,26.25 24.89,26.25 v23.88,27.26
V_POTI  (via drill 0.35)
  Top 0.508: R4.1 R5.1 69.22,26.88 v68.58,26.25 66.04,23.71 X4.P$1 | v62.23,54.19 R3.1
  Bottom 0.508: v68.58,26.25 62.23,32.59 v62.23,54.19
VCC  (via drill 0.35)
  Top 0.203: U1.2 46.49,60.4 46.35,60.54 46.35,62.44 46.99,63.08 C12.2 47.46,63.8 v48.01,64.34 | v57.15,62.44 58.26,62.44 R17.2
  Top 0.508: D2.A 45.88,64.65 C12.2
  Bottom 0.203: v48.01,64.34 55.24,64.34 v57.15,62.44

### Text on the board
tPlace: LED + | Analog/PWM LED Dimmer / V01.yy | LED GND | LED On/Off | GND | 24V0 | 3V3 | Poti | GND | 24V_In | 24V_SW